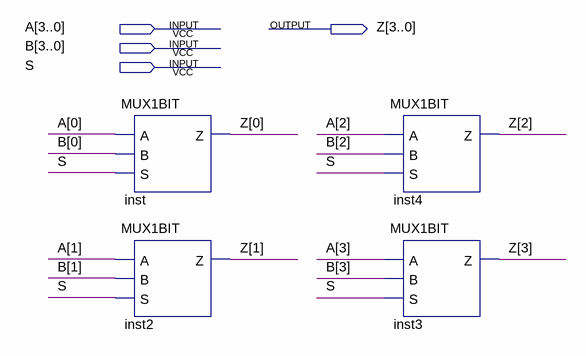
[diagram p0: schematic sheet]
// Quartus schematic MUX4BITS.bdf as structural Verilog: 4 symbols, 4 pins
module MUX4BITS (
  input  [3:0] A,
  input  [3:0] B,
  input  S,
  output [3:0] Z
);

  MUX1BIT inst (.A(A[0]), .B(B[0]), .S(S), .Z(Z[0]));
  MUX1BIT inst2 (.A(A[1]), .B(B[1]), .S(S), .Z(Z[1]));
  MUX1BIT inst4 (.A(A[2]), .B(B[2]), .S(S), .Z(Z[2]));
  MUX1BIT inst3 (.A(A[3]), .B(B[3]), .S(S), .Z(Z[3]));
endmodule
